# Altium schematic sheet Topsheet.SchDoc
size A4; PageSetup: Record=PageOptions|CenterHorizontal=True|CenterVertical=True|PrintScale=0.92|XCorrection=1.00|YCorrection=1.00|PrintKind=0|BorderSize=5000000|LeftOffset=0|BottomOffset=0|Orientation=2|PaperLength=1000|PaperWidth=1000|Scale=100|PaperSource=7|PrintQuality=-4|MediaType=1|DitherType=10|PrintScaleMode=1|PaperKind=A4; CompanyName: Technische Hochschule Nürnberg Georg Simon Ohm; Organization: UltraZohm; Address1: Kesslerplatz 12; Address2: 90489 Nürnberg; Address3: GERMANY; DocumentNumber: 5; SheetNumber: 5; SheetTotal: 5; Website: www.ultrazohm.com
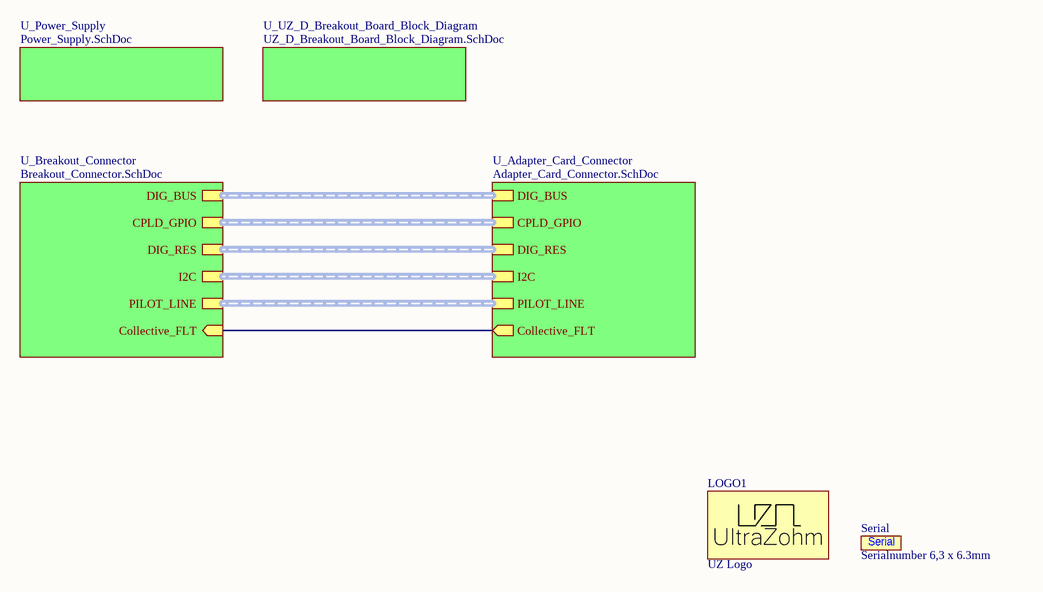
[diagram p0: Topsheet.SchDoc]

## Parts
LOGO1  UZ Logo  [UZ_Logo_small]  (no BOM)
Serial  Serialnumber 6,3 x 6.3mm  [Serial_6.3x6.3mm]  (no BOM)

## Sub-sheets
U_Adapter_Card_Connector = Adapter_Card_Connector.SchDoc: DIG_BUS (harness DIG_BUS), CPLD_GPIO (harness CPLD_GPIO), DIG_RES (harness DIG_RES), I2C (harness I2C), PILOT_LINE (harness PILOT_LINE), Collective_FLT (out)
U_Breakout_Connector = Breakout_Connector.SchDoc: DIG_BUS (harness DIG_BUS), CPLD_GPIO (harness CPLD_GPIO), DIG_RES (harness DIG_RES), I2C (harness I2C), PILOT_LINE (harness PILOT_LINE), Collective_FLT (in)
U_Power_Supply = Power_Supply.SchDoc: no entries
U_UZ_D_Breakout_Board_Block_Diagram = UZ_D_Breakout_Board_Block_Diagram.SchDoc: no entries

## Nets
(unnamed): sheet U_Adapter_Card_Connector/Collective_FLT, sheet U_Breakout_Connector/Collective_FLT

## Buses and harness runs
harness sheet U_Adapter_Card_Connector/CPLD_GPIO = sheet U_Breakout_Connector/CPLD_GPIO
harness sheet U_Adapter_Card_Connector/DIG_BUS = sheet U_Breakout_Connector/DIG_BUS
harness sheet U_Adapter_Card_Connector/DIG_RES = sheet U_Breakout_Connector/DIG_RES
harness sheet U_Adapter_Card_Connector/I2C = sheet U_Breakout_Connector/I2C
harness sheet U_Adapter_Card_Connector/PILOT_LINE = sheet U_Breakout_Connector/PILOT_LINE

## Notes on the sheet
- Title
- Revision:
- Design Engineer:
- Date:
- Project:
- Sheet
- of

## Library data of the parts
LOGO1 = UZ Logo: UltraZohm Logo on PCB; Created: Jan2021_Liegmann; Value: UZ Logo
Serial = SerialNumber: Created: 2018_09_18_AGeiger; Value: Serialnumber 6,3 x 6.3mm